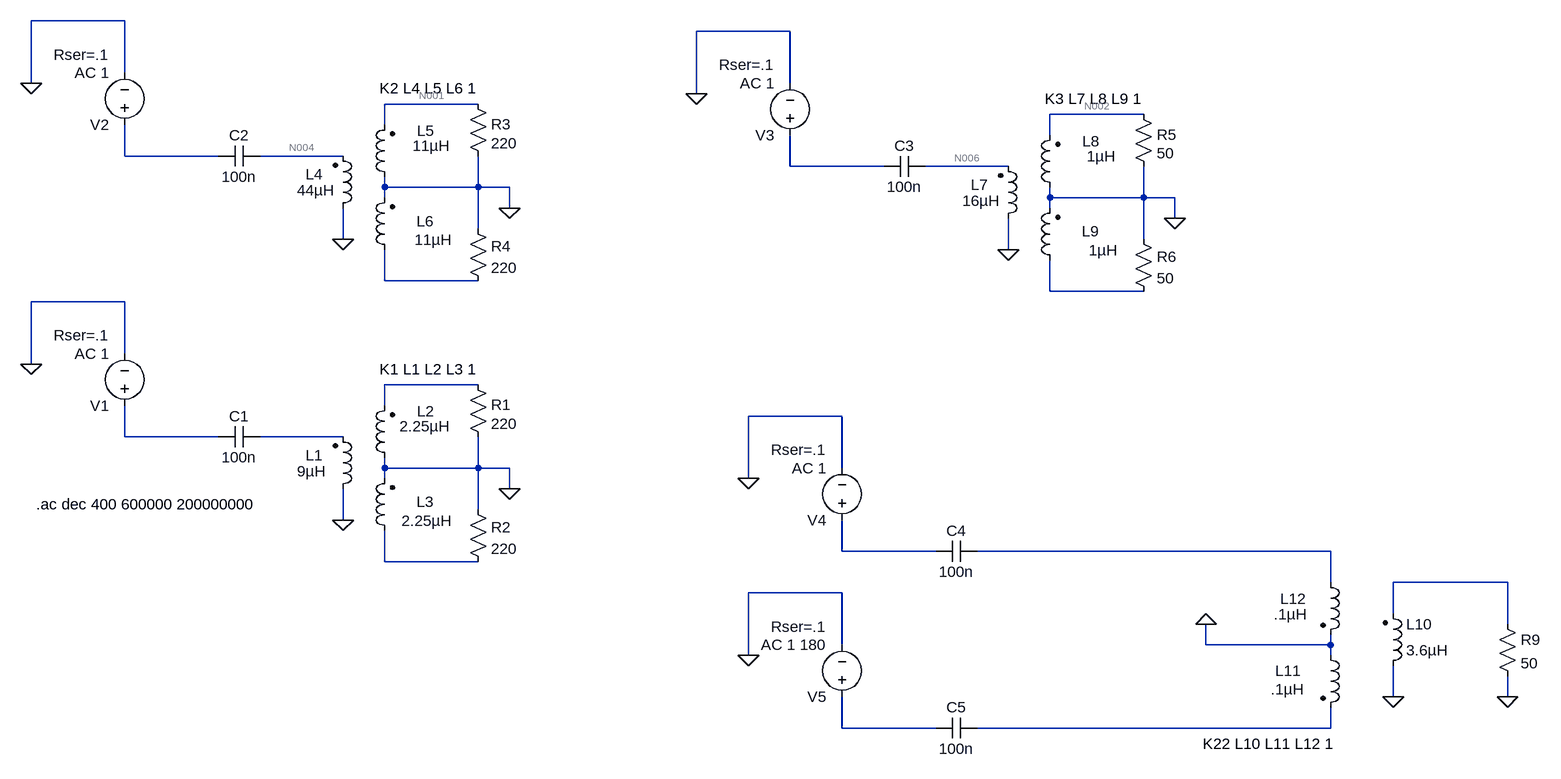
[diagram p0: schematic pushpull impedance.asc]
pushpull impedance.asc, the LTspice schematic file:
Version 4
SHEET 1 2272 768
WIRE -96 -368 -240 -368
WIRE 928 -352 784 -352
WIRE -96 -288 -96 -368
WIRE -240 -272 -240 -368
WIRE 928 -272 928 -352
WIRE 784 -256 784 -352
WIRE 448 -240 304 -240
WIRE 1472 -224 1328 -224
WIRE 304 -208 304 -240
WIRE 1328 -192 1328 -224
WIRE -96 -160 -96 -208
WIRE 48 -160 -96 -160
WIRE 240 -160 112 -160
WIRE 928 -144 928 -192
WIRE 1072 -144 928 -144
WIRE 1264 -144 1136 -144
WIRE 304 -112 304 -128
WIRE 448 -112 448 -160
WIRE 448 -112 304 -112
WIRE 496 -112 448 -112
WIRE 304 -96 304 -112
WIRE 1328 -96 1328 -112
WIRE 1472 -96 1472 -144
WIRE 1472 -96 1328 -96
WIRE 1520 -96 1472 -96
WIRE 496 -80 496 -112
WIRE 1328 -80 1328 -96
WIRE 1520 -64 1520 -96
WIRE 448 -48 448 -112
WIRE 240 -32 240 -80
WIRE 1472 -32 1472 -96
WIRE 1264 -16 1264 -64
WIRE 304 32 304 -16
WIRE 448 32 304 32
WIRE 1328 48 1328 0
WIRE 1472 48 1328 48
WIRE -96 64 -240 64
WIRE -96 144 -96 64
WIRE -240 160 -240 64
WIRE 448 192 304 192
WIRE 304 224 304 192
WIRE 1008 240 864 240
WIRE -96 272 -96 224
WIRE 48 272 -96 272
WIRE 240 272 112 272
WIRE 304 320 304 304
WIRE 448 320 448 272
WIRE 448 320 304 320
WIRE 496 320 448 320
WIRE 1008 320 1008 240
WIRE 304 336 304 320
WIRE 864 336 864 240
WIRE 496 352 496 320
WIRE 448 384 448 320
WIRE 240 400 240 352
WIRE 1008 448 1008 400
WIRE 1152 448 1008 448
WIRE 1760 448 1216 448
WIRE 304 464 304 416
WIRE 448 464 304 464
WIRE 1760 496 1760 448
WIRE 2032 496 1856 496
WIRE 1008 512 864 512
WIRE 1856 544 1856 496
WIRE 2032 560 2032 496
WIRE 1008 592 1008 512
WIRE 1568 592 1568 560
WIRE 1760 592 1760 576
WIRE 1760 592 1568 592
WIRE 864 608 864 512
WIRE 1760 608 1760 592
WIRE 1856 672 1856 624
WIRE 2032 672 2032 640
WIRE 1008 720 1008 672
WIRE 1152 720 1008 720
WIRE 1760 720 1760 688
WIRE 1760 720 1216 720
FLAG 240 400 0
FLAG -240 160 0
FLAG 496 352 0
FLAG 240 -32 0
FLAG -240 -272 0
FLAG 496 -80 0
FLAG 1264 -16 0
FLAG 784 -256 0
FLAG 1520 -64 0
FLAG 1856 672 0
FLAG 864 336 0
FLAG 1568 560 0
FLAG 2032 672 0
FLAG 864 608 0
SYMBOL ind2 224 368 M180
WINDOW 0 -42 68 Left 2
WINDOW 3 -55 43 Left 2
SYMATTR InstName L1
SYMATTR Value 9µH
SYMATTR Type ind
SYMBOL ind2 320 320 R180
WINDOW 0 -61 87 Left 2
WINDOW 3 -85 64 Left 2
SYMATTR InstName L2
SYMATTR Value 2.25µH
SYMATTR Type ind
SYMBOL ind2 320 432 R180
WINDOW 0 -60 60 Left 2
WINDOW 3 -88 31 Left 2
SYMATTR InstName L3
SYMATTR Value 2.25µH
SYMATTR Type ind
SYMBOL res 432 176 R0
WINDOW 0 36 47 Left 2
SYMATTR InstName R1
SYMATTR Value 220
SYMBOL res 432 368 R0
WINDOW 0 36 43 Left 2
SYMATTR InstName R2
SYMATTR Value 220
SYMBOL voltage -96 240 R180
WINDOW 123 24 96 Left 2
WINDOW 39 24 124 Left 2
WINDOW 3 46 103 Left 2
SYMATTR Value2 AC 1
SYMATTR SpiceLine Rser=.1
SYMATTR Value ""
SYMATTR InstName V1
SYMBOL cap 112 256 R90
WINDOW 0 0 32 VBottom 2
WINDOW 3 32 32 VTop 2
SYMATTR InstName C1
SYMATTR Value 100n
SYMBOL ind2 224 -64 M180
WINDOW 0 -42 68 Left 2
WINDOW 3 -55 43 Left 2
SYMATTR InstName L4
SYMATTR Value 44µH
SYMATTR Type ind
SYMBOL ind2 320 -112 R180
WINDOW 0 -61 87 Left 2
WINDOW 3 -85 64 Left 2
SYMATTR InstName L5
SYMATTR Value 11µH
SYMATTR Type ind
SYMBOL ind2 320 0 R180
WINDOW 0 -60 60 Left 2
WINDOW 3 -88 31 Left 2
SYMATTR InstName L6
SYMATTR Value 11µH
SYMATTR Type ind
SYMBOL res 432 -256 R0
WINDOW 0 36 47 Left 2
SYMATTR InstName R3
SYMATTR Value 220
SYMBOL res 432 -64 R0
WINDOW 0 36 43 Left 2
SYMATTR InstName R4
SYMATTR Value 220
SYMBOL voltage -96 -192 R180
WINDOW 123 24 96 Left 2
WINDOW 39 24 124 Left 2
WINDOW 3 46 103 Left 2
SYMATTR Value2 AC 1
SYMATTR SpiceLine Rser=.1
SYMATTR Value ""
SYMATTR InstName V2
SYMBOL cap 112 -176 R90
WINDOW 0 0 32 VBottom 2
WINDOW 3 32 32 VTop 2
SYMATTR InstName C2
SYMATTR Value 100n
SYMBOL ind2 1248 -48 M180
WINDOW 0 -42 68 Left 2
WINDOW 3 -55 43 Left 2
SYMATTR InstName L7
SYMATTR Value 16µH
SYMATTR Type ind
SYMBOL ind2 1344 -96 R180
WINDOW 0 -61 87 Left 2
WINDOW 3 -85 64 Left 2
SYMATTR InstName L8
SYMATTR Value 1µH
SYMATTR Type ind
SYMBOL ind2 1344 16 R180
WINDOW 0 -60 60 Left 2
WINDOW 3 -88 31 Left 2
SYMATTR InstName L9
SYMATTR Value 1µH
SYMATTR Type ind
SYMBOL res 1456 -240 R0
WINDOW 0 36 47 Left 2
SYMATTR InstName R5
SYMATTR Value 50
SYMBOL res 1456 -48 R0
WINDOW 0 36 43 Left 2
SYMATTR InstName R6
SYMATTR Value 50
SYMBOL voltage 928 -176 R180
WINDOW 123 24 96 Left 2
WINDOW 39 24 124 Left 2
WINDOW 3 46 103 Left 2
SYMATTR Value2 AC 1
SYMATTR SpiceLine Rser=.1
SYMATTR Value ""
SYMATTR InstName V3
SYMBOL cap 1136 -160 R90
WINDOW 0 0 32 VBottom 2
WINDOW 3 32 32 VTop 2
SYMATTR InstName C3
SYMATTR Value 100n
SYMBOL ind2 1840 640 M180
WINDOW 0 36 80 Left 2
WINDOW 3 36 40 Left 2
SYMATTR InstName L10
SYMATTR Value 3.6µH
SYMATTR Type ind
SYMBOL ind2 1744 592 R0
WINDOW 0 -69 40 Left 2
WINDOW 3 -76 68 Left 2
SYMATTR InstName L11
SYMATTR Value .1µH
SYMATTR Type ind
SYMBOL ind2 1744 480 R0
WINDOW 0 -62 41 Left 2
WINDOW 3 -72 65 Left 2
SYMATTR InstName L12
SYMATTR Value .1µH
SYMATTR Type ind
SYMBOL voltage 1008 416 R180
WINDOW 123 24 96 Left 2
WINDOW 39 24 124 Left 2
WINDOW 3 46 103 Left 2
SYMATTR Value2 AC 1
SYMATTR SpiceLine Rser=.1
SYMATTR Value ""
SYMATTR InstName V4
SYMBOL cap 1216 432 R90
WINDOW 0 0 32 VBottom 2
WINDOW 3 32 32 VTop 2
SYMATTR InstName C4
SYMATTR Value 100n
SYMBOL res 2016 544 R0
SYMATTR InstName R9
SYMATTR Value 50
SYMBOL voltage 1008 688 R180
WINDOW 123 24 96 Left 2
WINDOW 39 24 124 Left 2
WINDOW 3 46 103 Left 2
SYMATTR Value2 AC 1 180
SYMATTR SpiceLine Rser=.1
SYMATTR Value ""
SYMATTR InstName V5
SYMBOL cap 1216 704 R90
WINDOW 0 0 32 VBottom 2
WINDOW 3 32 32 VTop 2
SYMATTR InstName C5
SYMATTR Value 100n
TEXT 296 168 Left 2 !K1 L1 L2 L3 1
TEXT -232 376 Left 2 !.ac dec 400 600000 200000000
TEXT 296 -264 Left 2 !K2 L4 L5 L6 1
TEXT 1320 -248 Left 2 !K3 L7 L8 L9 1
TEXT 1768 744 Right 2 !K22 L10 L11 L12 1

The netlist it stands for:
* pushpull impedance.asc
L1 0 N011 9µH
L2 0 N009 2.25µH
L3 N014 0 2.25µH
R1 N009 0 220
R2 0 N014 220
V1 N010 0 AC 1 Rser=.1
C1 N011 N010 100n
L4 0 N004 44µH
L5 0 N001 11µH
L6 N007 0 11µH
R3 N001 0 220
R4 0 N007 220
V2 N003 0 AC 1 Rser=.1
C2 N004 N003 100n
L7 0 N006 16µH
L8 0 N002 1µH
L9 N008 0 1µH
R5 N002 0 50
R6 0 N008 50
V3 N005 0 AC 1 Rser=.1
C3 N006 N005 100n
L10 0 N015 3.6µH
L11 0 N017 .1µH
L12 N013 0 .1µH
V4 N012 0 AC 1 Rser=.1
C4 N013 N012 100n
R9 N015 0 50
V5 N016 0 AC 1 180 Rser=.1
C5 N017 N016 100n
K1 L1 L2 L3 1
.ac dec 400 600000 200000000
K2 L4 L5 L6 1
K3 L7 L8 L9 1
K22 L10 L11 L12 1
.backanno
.end

* Results of the author's LTspice run, read from the files saved beside the schematic
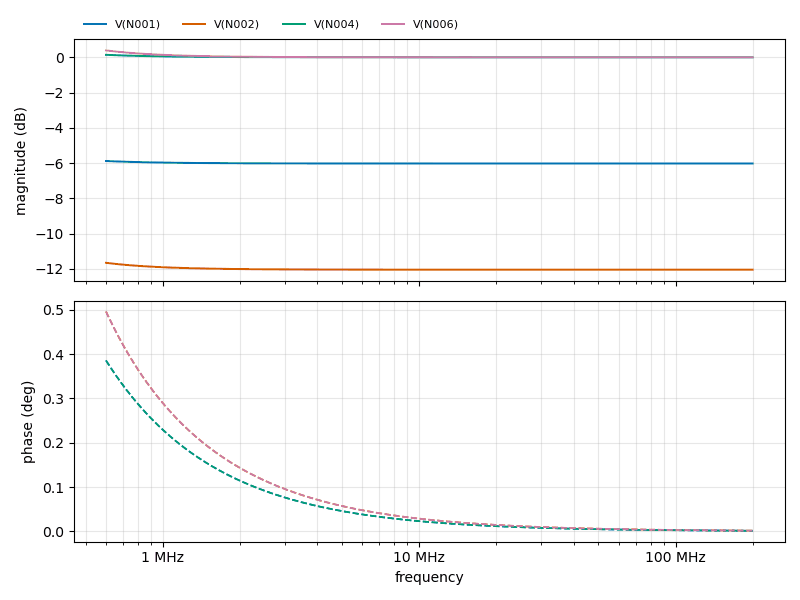
[diagram p1: AC Analysis of pushpull impedance.asc, plotted from the saved traces]
* AC Analysis, 1 run:
*   V(N001): -5.88 dB at 600 kHz, -6.02 dB at 200 MHz, peak -5.88 dB at 600 kHz
*   V(N002): -11.65 dB at 600 kHz, -12.04 dB at 200 MHz, peak -11.65 dB at 600 kHz
*   V(N004): 0.14 dB at 600 kHz, -0.00 dB at 200 MHz, peak 0.14 dB at 600 kHz
*   V(N006): 0.39 dB at 600 kHz, -0.00 dB at 200 MHz, peak 0.39 dB at 600 kHz